# Altium schematic sheet Sheet1.SchDoc: Lamp
size A4; DocumentNumber: 1; SheetNumber: 1; SheetTotal: 2
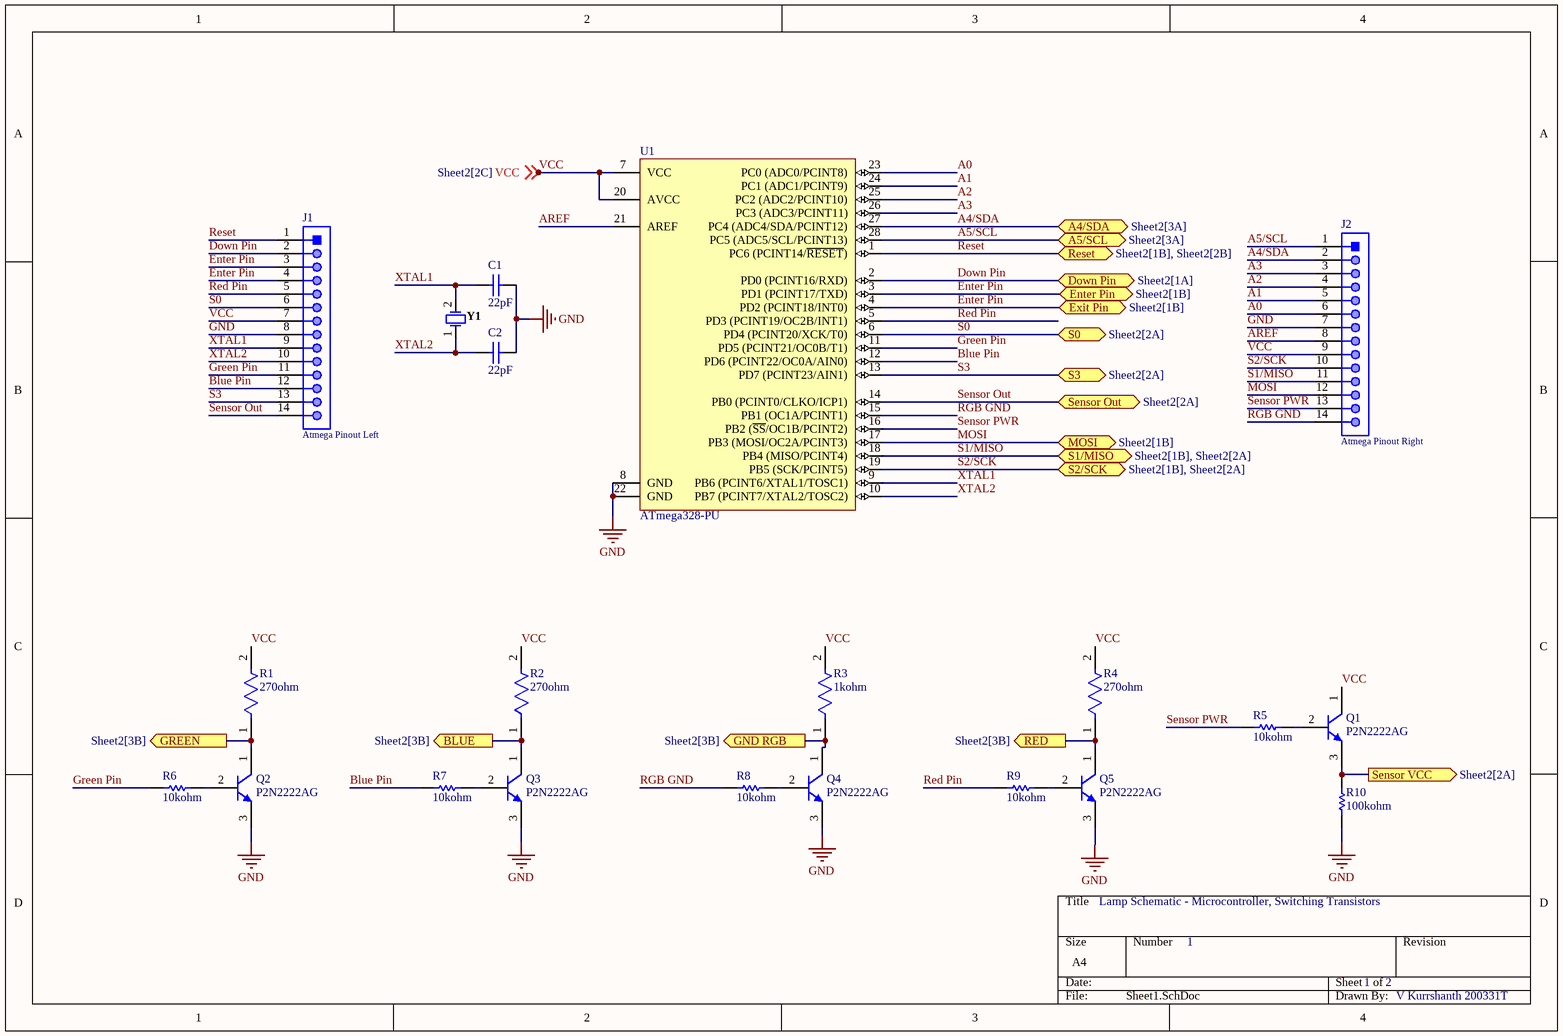
[diagram p0: Sheet1.SchDoc]

## Parts
C1  22pF  [KEMT-C315-THT-2]
C2  22pF  [KEMT-C315-THT-2]
J1  Atmega Pinout Left  [61301411121]
J2  Atmega Pinout Right  [61301411121]
Q1  P2N2222AG  [ONSC-TO-92-3-29-11]
Q2  P2N2222AG  [ONSC-TO-92-3-29-11]
Q3  P2N2222AG  [ONSC-TO-92-3-29-11]
Q4  P2N2222AG  [ONSC-TO-92-3-29-11]
Q5  P2N2222AG  [ONSC-TO-92-3-29-11]
R1  270ohm  [FP-CFR50J2K2-MFG]
R2  270ohm  [FP-CFR50J2K2-MFG]
R3  1kohm  [FP-CFR50J2K2-MFG]
R4  270ohm  [FP-CFR50J2K2-MFG]
R5  10kohm  [RESA60-630X240]
R6  10kohm  [RESA60-630X240]
R7  10kohm  [RESA60-630X240]
R8  10kohm  [RESA60-630X240]
R9  10kohm  [RESA60-630X240]
R10  100kohm  [RESA60-630X240]
U1  ATmega328-PU  [28P3]
Y1  FOXSLF/160-20  [FOX-FOXSLF160-20]  (value not drawn)

## Ports
A4/SDA (bidir, see Sheet2[3A]), A5/SCL (bidir, see Sheet2[3A]), BLUE (out, see Sheet2[3B]), Down Pin (bidir, see Sheet2[1A]), Enter Pin (bidir, see Sheet2[1B]), Exit Pin (bidir, see Sheet2[1B]), GND RGB (out, see Sheet2[3B]), GREEN (out, see Sheet2[3B]), MOSI (bidir, see Sheet2[1B]), RED (out, see Sheet2[3B]), Reset (bidir, see Sheet2[1B], Sheet2[2B]), S0 (bidir, see Sheet2[2A]), S1/MISO (bidir, see Sheet2[1B], Sheet2[2A]), S2/SCK (bidir, see Sheet2[1B], Sheet2[2A]), S3 (bidir, see Sheet2[2A]), Sensor Out (bidir, see Sheet2[2A]), Sensor VCC (out, see Sheet2[2A])

## Nets
GND: C1.2 C2.2 J1.8 J2.7 Q2.3(E) Q3.3(E) Q4.3(E) Q5.3(E) R10.1 U1.8(GND) U1.22(GND)
A0: J2.6 U1.23(PC0_(ADC0/PCINT8))
A1: J2.5 U1.24(PC1_(ADC1/PCINT9))
A2: J2.4 U1.25(PC2_(ADC2/PCINT10))
A3: J2.3 U1.26(PC3_(ADC3/PCINT11))
A4/SDA: J2.2 U1.27(PC4_(ADC4/SDA/PCINT12)) ; port A4/SDA
A5/SCL: J2.1 U1.28(PC5_(ADC5/SCL/PCINT13)) ; port A5/SCL
AREF: J2.8 U1.21(AREF)
BLUE: Q3.1(C) R2.1 ; port BLUE
Blue Pin: J1.12 R7.1 U1.12(PD6_(PCINT22/OC0A/AIN0))
Down Pin: J1.2 U1.2(PD0_(PCINT16/RXD)) ; port Down Pin
Enter Pin: J1.3 J1.4 U1.3(PD1_(PCINT17/TXD)) U1.4(PD2_(PCINT18/INT0)) ; port Enter Pin, port Exit Pin
GND RGB: Q4.1(C) R3.1 ; port GND RGB
GREEN: Q2.1(C) R1.1 ; port GREEN
Green Pin: J1.11 R6.1 U1.11(PD5_(PCINT21/OC0B/T1))
MOSI: J2.12 U1.17(PB3_(MOSI/OC2A/PCINT3)) ; port MOSI
RED: Q5.1(C) R4.1 ; port RED
Red Pin: J1.5 R9.1 U1.5(PD3_(PCINT19/OC2B/INT1))
Reset: J1.1 U1.1(PC6_(PCINT14/~{RESET})) ; port Reset
RGB GND: J2.14 R8.1 U1.15(PB1_(OC1A/PCINT1))
S0: J1.6 U1.6(PD4_(PCINT20/XCK/T0)) ; port S0
S1/MISO: J2.11 U1.18(PB4_(MISO/PCINT4)) ; port S1/MISO
S2/SCK: J2.10 U1.19(PB5_(SCK/PCINT5)) ; port S2/SCK
S3: J1.13 U1.13(PD7_(PCINT23/AIN1)) ; port S3
Sensor Out: J1.14 U1.14(PB0_(PCINT0/CLKO/ICP1)) ; port Sensor Out
Sensor PWR: J2.13 R5.1 U1.16(PB2_(~{SS}/OC1B/PCINT2))
Sensor VCC: Q1.3(E) R10.2 ; port Sensor VCC
VCC: J1.7 J2.9 Q1.1(C) R1.2 R2.2 R3.2 R4.2 U1.7(VCC) U1.20(AVCC) ; off-sheet VCC
XTAL1: C1.1 J1.9 U1.9(PB6_(PCINT6/XTAL1/TOSC1)) Y1.2
XTAL2: C2.1 J1.10 U1.10(PB7_(PCINT7/XTAL2/TOSC2)) Y1.1
NetQ1_2: Q1.2(B) R5.2
NetQ2_2: Q2.2(B) R6.2
NetQ3_2: Q3.2(B) R7.2
NetQ4_2: Q4.2(B) R8.2
NetQ5_2: Q5.2(B) R9.2

## Notes on the sheet
- Lamp Schematic - Microcontroller, Switching Transistors
- 1
- 2
- V Kurrshanth 200331T

## Library data of the parts
C1 C2 = CMP-1664-00008-1: Capacitor, Ceramic, 22 pF, +/-10 %, 100 V, -55 to 125 degC, 2-Pin THD, RoHS, Bulk; Max Input Voltage: 40 V; Min Input Voltage: 4.2 V; Output Current: 1.5 A; Output Voltage: 1.2 V; Outputs: 1; Case\Package: TO-220; RoHSCompliant: true; Min Operating Temperature: 0 degC; Max Operating Temperature: 125 degC; Package Quantity: 50; ComponentLink2URL: http://capacitoredge.kemet.com/capedge2/DataSheet/Datasheet-C315C220K1G5TA.pdf?pn=C315C220K1G5TA{BULK}; Radiation Hardening: No; Pins: 3; Length: 10.28 mm; ComponentLink1URL: http://www.kemet.com/; ComponentLink2Description: Datasheet; Height: 9.28 mm; REACH SVHC: No SVHC; ComponentLink1Description: Manufacturer URL; Max Ouput Current: 1.5 A; Weight: 0.08113 oz; Packaging: Rail/Tube; DatasheetVersion: Aug-16; Mount: Through Hole; PackageReference: C315-THT-2; Width: 4.82 mm; PackageDescription: 2-Pin Through Hole Device, Body 3.81 x 2.54 mm
J1 J2 = CMP-1502-01091-1: THT Vertical Pin Header WR-PHD, Pitch 2.54 mm, Single Row, 14 pins; Manufacturer: Wurth Elektronik; Pin Number: 14; Working Voltage: 250VAC; Withstanding Voltage: 500VAC; Pitch: 2.54mm; Gender: Male; Contact Resistance: 20mOhm; Rated Current: 3A; Manufacturer URL: http://www.we-online.de; Mounting Technology: THT; Packaging: Bag; Part Number: 61301411121; Orientation: Vertical; Publisher: WurthElektronik; Operating Temperature: -40to105degC; Datasheet URL: https://katalog.we-online.de/em/datasheet/6130xx11121.pdf; Package Reference: 61301411121; Row Number: Single
Q1-Q5 = CMP-1048-01402-1: Amplifier Transistor, NPN Silicon, 3-Pin TO-92, Pb-Free, Bulk Box; Manufacturer: On Semiconductor; IC Continuous (A): 0.6; fT Min (MHz): 300; ComponentLink2Description: Datasheet; ComponentLink1Description: Manufacturer URL; ComponentLink2URL: http://www.onsemi.com/pub_link/Collateral/P2N2222A-D.PDF; ComponentLink3Description: Package Specification; RoHS: TRUE; ComponentLink1URL: http://www.onsemi.com/; PartNumber: P2N2222AG; Mounting Technology: Through Hole; PackageReference: TO-92-3-29-11_AM_SL; Polarity: NPN; Packing: Bulk Box; DatasheetVersion: Rev. 7; PackageDescription: 3-Pin Transistor Outline, Body 4.825 x 3.685 mm, Pitch 1.27 mm; PackageVersion: Rev. AM; ComponentLink3URL: http://www.onsemi.cn/pub_link/Collateral/2N6426-D.PDF
R1 R2 R4 = CMP-03212-000011-1: RES 270 OHM 5% 1/2W AXIAL; Temperature Coefficient: 0ppm/°C; Max Power Dissipation: 500mW; Resistance: 2.2kR; Number of Resistors: 1; Voltage Rating (DC): 350V; Case/Package: Axial; Number of Terminations: 2; REACH SVHC: No SVHC; Mount: Axial; Packaging: Cut Tape; Min Operating Temperature: -55°C; Series: CFR50, Neohm; Resistor Type: Thin Film; Tolerance: 5%; Radiation Hardening: No; Package Quantity: 3000; Power Rating: 500mW; Length: 9mm; Termination: Axial; Max Operating Temperature: 155°C; ELV: Compliant; Voltage Rating: 350V; Resistance Tolerance: 5%; Technology: CARBON FILM; Diameter: 3mm; RoHS Compliant: Yes
R3 = CMP-03212-000011-1: RES 1k OHM 5% 1/2W AXIAL; Temperature Coefficient: 0ppm/°C; Max Power Dissipation: 500mW; Resistance: 2.2kR; Number of Resistors: 1; Voltage Rating (DC): 350V; Case/Package: Axial; Number of Terminations: 2; REACH SVHC: No SVHC; Mount: Axial; Packaging: Cut Tape; Min Operating Temperature: -55°C; Series: CFR50, Neohm; Resistor Type: Thin Film; Tolerance: 5%; Radiation Hardening: No; Package Quantity: 3000; Power Rating: 500mW; Length: 9mm; Termination: Axial; Max Operating Temperature: 155°C; ELV: Compliant; Voltage Rating: 350V; Resistance Tolerance: 5%; Technology: CARBON FILM; Diameter: 3mm; RoHS Compliant: Yes
R5-R9 = CMP-1659-00074-2: Axial Resistor, 10 KOhm, +/- 1%, 0.25 W, -55 to 155 degC, 2-Pin THD, RoHS, Bulk; Manufacturer: Yageo; Temperature Coefficient: 100ppm\/degreesC; Voltage Rating: 250V; Voltage Rating (DC): 200V; Max Power Dissipation: 250mW; Datasheet URL: http://www.yageo.com/documents/recent/Yageo%20LR_MFR_2013.pdf; Packaging: Bulk; RoHSCompliant: True; Mount: ThroughHole; Package Reference: MFR-25; Termination: Axial; Composition: MetalFilm; Number of Terminations: 2; Resistance: 10KOhm; Package Quantity: 200; Mounting Technology: ThroughHole; Length: 0.248inch; Max Operating Temperature: 155degC; Min Operating Temperature: -55degC; Datasheet Version: 04/2013; Lead Free: LeadFree; Manufacturer URL: http://www.yageo.com/; Tolerance: 1%; Power Rating: 250mW; Package Description: 2-Pin Axial Lead, Dia 2.4 mm, Body Length 6.3 mm; Military Standard: Not; Case\/Package: Axial
R10 = CMP-1659-00074-2: Axial Resistor, 100 KOhm, +/- 1%, 0.25 W, -55 to 155 degC, 2-Pin THD, RoHS, Bulk; Manufacturer: Yageo; Temperature Coefficient: 100ppm\/degreesC; Voltage Rating: 250V; Voltage Rating (DC): 200V; Resistance: 10KOhm; Max Power Dissipation: 250mW; Datasheet URL: http://www.yageo.com/documents/recent/Yageo%20LR_MFR_2013.pdf; Packaging: Bulk; RoHSCompliant: True; Mount: ThroughHole; Package Reference: MFR-25; Termination: Axial; Composition: MetalFilm; Number of Terminations: 2; Package Quantity: 200; Mounting Technology: ThroughHole; Length: 0.248inch; Max Operating Temperature: 155degC; Min Operating Temperature: -55degC; Datasheet Version: 04/2013; Lead Free: LeadFree; Manufacturer URL: http://www.yageo.com/; Tolerance: 1%; Power Rating: 250mW; Package Description: 2-Pin Axial Lead, Dia 2.4 mm, Body Length 6.3 mm; Military Standard: Not; Case\/Package: Axial
U1 = CMP-0095-00015-2: 8-bit AVR Microcontroller, 32KB Flash, 1KB EEPROM, 2KB SRAM, 28-pin PDIP, Industrial Grade (-40°C to 85°C); ComponentLink3Description: ATmega48A/48PA/88A/88PA/168A/168PA/328/328P Summary; RevisionNote: DatasheetVersion updated. URLs added.; DatasheetVersion: revD, May-2011; ComponentLink1URL: http://www.atmel.com/; PackageVersion: revB, Sep-2001; PackageDescription: 28-lead (0.300"/7.62mm Wide) Plastic Dual Inline Package (PDIP); PackageReference: 28P3; ComponentLink1Description: Manufacturer URL; ComponentLink2Description: ATmega48A/48PA/88A/88PA/168A/168PA/328/328P Datasheet; ComponentLink3URL: http://www.atmel.com/dyn/resources/prod_documents/8271S.pdf; ComponentLink2URL: http://www.atmel.com/dyn/resources/prod_documents/8271.pdf
Y1 = CMP-1749-00003-1: Resistance Weld Thru-Hole Crystal, 16 MHz, -20 to 70 degC, 2-Pin THD, RoHS, Bulk; Voltage Rating: 250 V; Tolerance: 1%; Resistance: 221 kohm; Case\Package: Axial; Power Rating: 250 mW; RoHSCompliant: true; Package Quantity: 200; Packaging: Bulk; Min Operating Temperature: -55 degC; DatasheetVersion: Mar-15; ComponentLink1URL: http://www.foxonline.com/; Max Operating Temperature: 155 degC; PackageReference: FOXSLF160-20; Mount: Through Hole; PackageDescription: 2-Pin Through Hole Device, Body 11.35 x 4.65 mm; ComponentLink1Description: Manufacturer URL; ComponentLink2URL: http://www.foxonline.com/pdfs/hc49slf.pdf; ComponentLink2Description: Datasheet; Length: 0.248 inch